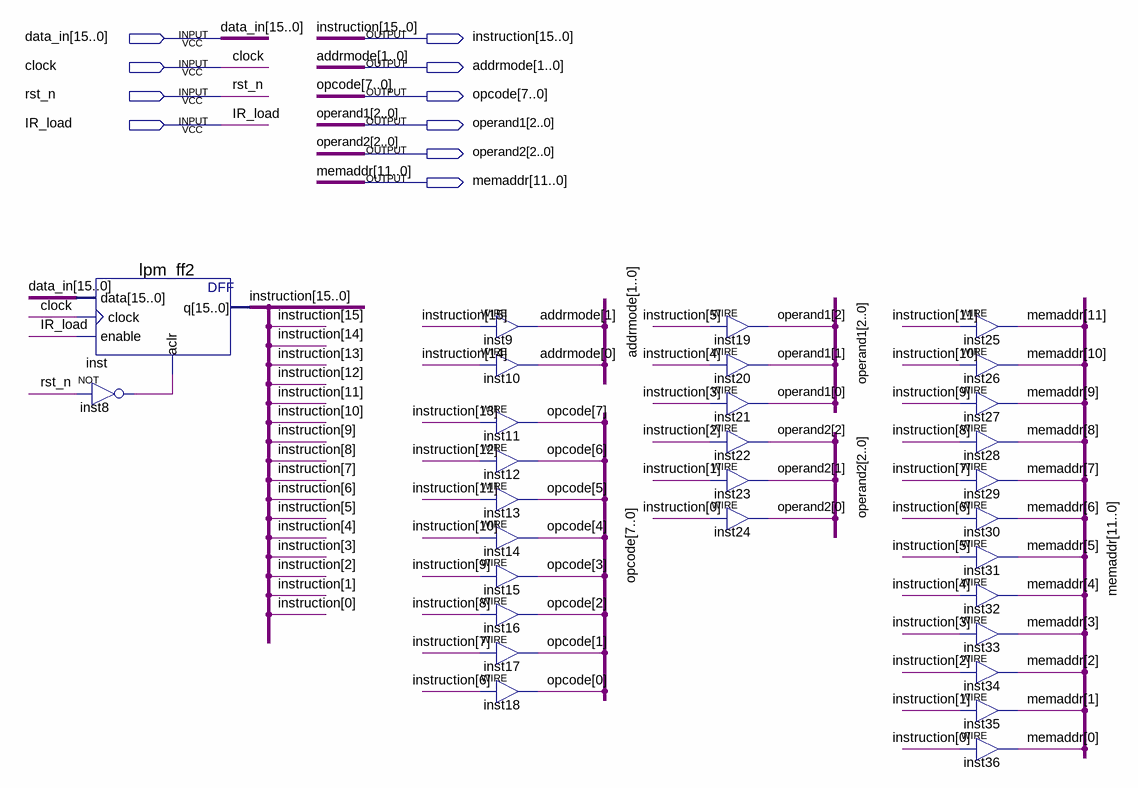
[diagram p0: schematic sheet]
// Quartus schematic ir_unit.bdf as structural Verilog: 30 symbols, 10 pins
module ir_unit (
  input  [15:0] data_in,
  input  clock,
  input  rst_n,
  input  IR_load,
  output [15:0] instruction,
  output [1:0] addrmode,
  output [7:0] opcode,
  output [2:0] operand1,
  output [2:0] operand2,
  output [11:0] memaddr
);

  wire inst8_out;

  lpm_ff2 inst (.data(data_in), .clock(clock), .enable(IR_load), .aclr(inst8_out), .q(instruction));
  not inst8 (inst8_out, rst_n);
  assign addrmode[1] = instruction[15];  // WIRE inst9
  assign addrmode[0] = instruction[14];  // WIRE inst10
  assign opcode[7] = instruction[13];  // WIRE inst11
  assign opcode[6] = instruction[12];  // WIRE inst12
  assign opcode[5] = instruction[11];  // WIRE inst13
  assign opcode[4] = instruction[10];  // WIRE inst14
  assign opcode[3] = instruction[9];  // WIRE inst15
  assign opcode[2] = instruction[8];  // WIRE inst16
  assign opcode[1] = instruction[7];  // WIRE inst17
  assign opcode[0] = instruction[6];  // WIRE inst18
  assign operand1[2] = instruction[5];  // WIRE inst19
  assign operand1[1] = instruction[4];  // WIRE inst20
  assign operand1[0] = instruction[3];  // WIRE inst21
  assign operand2[2] = instruction[2];  // WIRE inst22
  assign operand2[1] = instruction[1];  // WIRE inst23
  assign operand2[0] = instruction[0];  // WIRE inst24
  assign memaddr[11] = instruction[11];  // WIRE inst25
  assign memaddr[10] = instruction[10];  // WIRE inst26
  assign memaddr[9] = instruction[9];  // WIRE inst27
  assign memaddr[8] = instruction[8];  // WIRE inst28
  assign memaddr[7] = instruction[7];  // WIRE inst29
  assign memaddr[6] = instruction[6];  // WIRE inst30
  assign memaddr[5] = instruction[5];  // WIRE inst31
  assign memaddr[4] = instruction[4];  // WIRE inst32
  assign memaddr[3] = instruction[3];  // WIRE inst33
  assign memaddr[2] = instruction[2];  // WIRE inst34
  assign memaddr[1] = instruction[1];  // WIRE inst35
  assign memaddr[0] = instruction[0];  // WIRE inst36
endmodule
